# EAGLE design ChassisCab-mega328 (EAGLE 8.1.0)
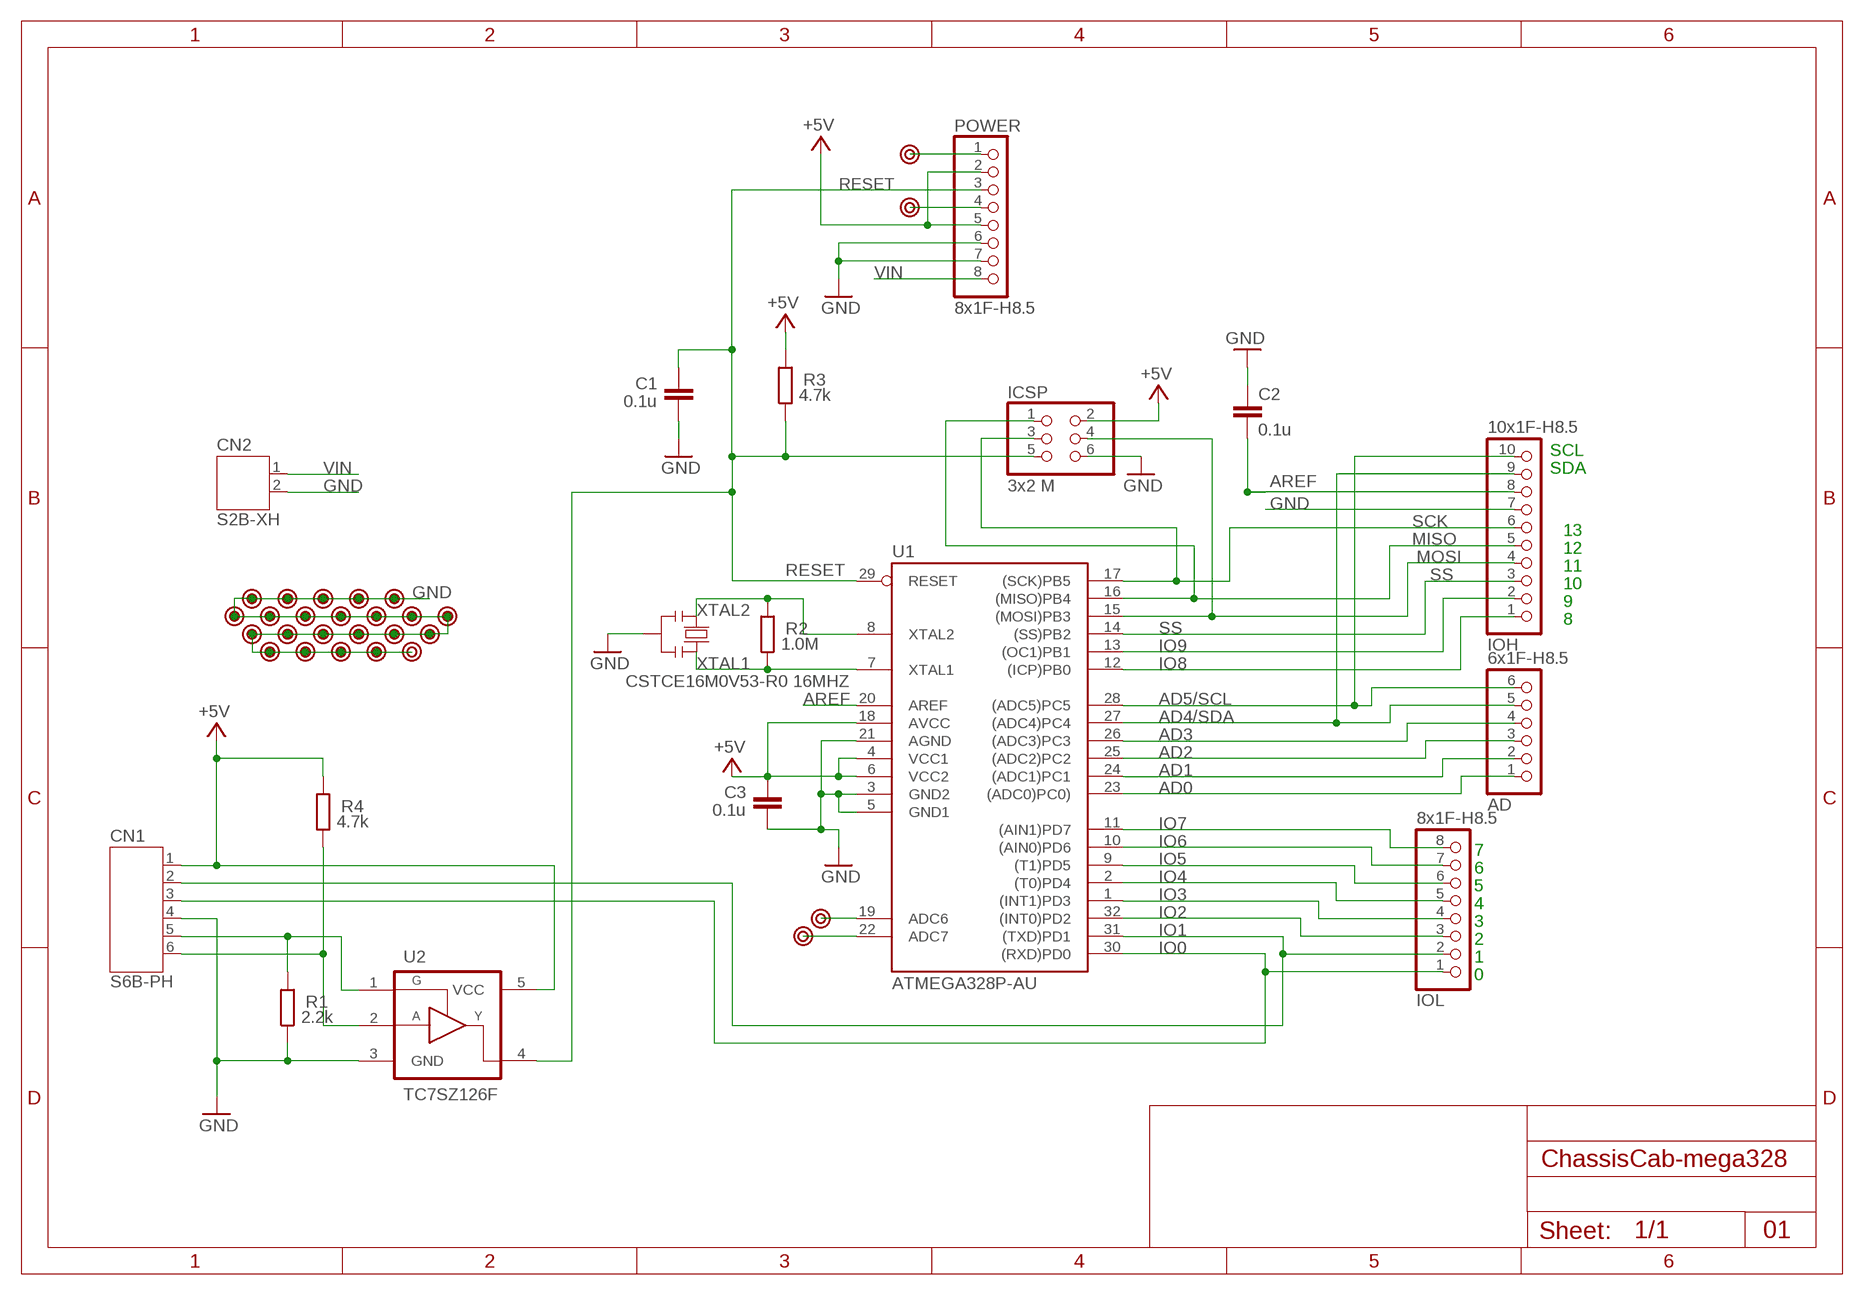
[diagram p0: schematic, sheet 1]

## Parts
AD  6x1F-H8.5  PINHD-1X6  [1X06]
C1  0.1u  C-EUC0603  [C0603]
C2  0.1u  C-EUC0603  [C0603]
C3  0.1u  C-EUC0603  [C0603]
CN1  S6B-PH  [S6B-PH]
CN2  S2B-XH  [S2B-XH]
ICSP  3x2 M  PINHD-2X3  [2X03]
IOH  10x1F-H8.5  PINHD-1X10_ARD  [1X10]
IOL  8x1F-H8.5  PINHD-1X8  [1X08]
POWER  8x1F-H8.5  PINHD-1X8  [1X08]
R1  2.2k  R-EU_R0603  [R0603]
R2  1.0M  R-EU_R0603  [R0603]
R3  4.7k  R-EU_R0603  [R0603]
R4  4.7k  R-EU_R0603  [R0603]
U1  ATMEGA328P-AU  [TQFP32]
U2  TC7SZ126F  [SMV]
U$1  PAD  [PAD]
U$2  PAD  [PAD]
U$3  PAD  [PAD]
U$4  PAD  [PAD]
U$5  PAD  [PAD]
U$6  PAD  [PAD]
U$7  PAD  [PAD]
U$8  PAD  [PAD]
U$9  PAD  [PAD]
U$10  PAD  [PAD]
U$11  PAD  [PAD]
U$12  PAD  [PAD]
U$13  PAD  [PAD]
U$14  PAD  [PAD]
U$15  PAD  [PAD]
U$16  PAD  [PAD]
U$17  PAD  [PAD]
U$18  PAD  [PAD]
U$19  PAD  [PAD]
U$20  PAD  [PAD]
U$21  PAD  [PAD]
U$22  PAD  [PAD]
U$23  PAD  [PAD]
U$24  PAD  [PAD]
U$25  PAD  [PAD]
U$26  PAD  [PAD]
U$27  PAD  [PAD]
X1  CSTCE16M0V53-R0 16MHZ  CSTCE16M0V53-R0  [CSTCE_V]

## Nets
+5V [power]: C3.2 CN1.1 ICSP.2 POWER.2 POWER.5 R3.2 R4.2 U1.4(VCC1) U1.6(VCC2) U1.18(AVCC) U2.5(VCC)
AD0: AD.1 U1.23((ADC0)PC0))
AD1: AD.2 U1.24((ADC1)PC1)
AD2: AD.3 U1.25((ADC2)PC2)
AD3: AD.4 U1.26((ADC3)PC3)
AD4/SDA: AD.5 IOH.9 U1.27((ADC4)PC4)
AD5/SCL: AD.6 IOH.10 U1.28((ADC5)PC5)
AD6: U1.19(ADC6) U$1.1
AD7: U1.22(ADC7) U$2.1
AREF [aref]: C2.2 IOH.8 U1.20(AREF)
GND [gnd]: C1.1 C2.1 C3.1 CN1.4 CN2.2 ICSP.6 IOH.7 POWER.6 POWER.7 R1.1 U1.3(GND2) U1.5(GND1) U1.21(AGND) U2.3(GND) U$3.1 U$4.1 U$5.1 U$6.1 U$7.1 U$8.1 U$9.1 U$10.1 U$11.1 U$12.1 U$13.1 U$14.1 U$15.1 U$16.1 U$17.1 U$18.1 U$19.1 U$20.1 U$21.1 U$22.1 U$23.1 U$24.1 U$27.1 X1.2
IO0: CN1.3 IOL.1 U1.30((RXD)PD0)
IO1: CN1.2 IOL.2 U1.31((TXD)PD1)
IO2: IOL.3 U1.32((INT0)PD2)
IO3: IOL.4 U1.1((INT1)PD3)
IO4: IOL.5 U1.2((T0)PD4)
IO5: IOL.6 U1.9((T1)PD5)
IO6: IOL.7 U1.10((AIN0)PD6)
IO7: IOL.8 U1.11((AIN1)PD7)
IO8: IOH.1 U1.12((ICP)PB0)
IO9: IOH.2 U1.13((OC1)PB1)
MISO: ICSP.1 IOH.5 U1.16((MISO)PB4)
MOSI: ICSP.4 IOH.4 U1.15((MOSI)PB3)
N$1: CN1.5 R1.2 U2.1(G)
N$2: CN1.6 R4.1 U2.2(A)
N$3: POWER.1 U$25.1
N$4: POWER.4 U$26.1
RESET: C1.2 ICSP.5 POWER.3 R3.1 U1.29(RESET) U2.4(Y)
SCK: ICSP.3 IOH.6 U1.17((SCK)PB5)
SS: IOH.3 U1.14((SS)PB2)
VIN [power]: CN2.1 POWER.8
XTAL1: R2.1 U1.7(XTAL1) X1.3
XTAL2: R2.2 U1.8(XTAL2) X1.1

## Notes on the sheet
- SCL
- SDA
- 13
- 12
- 11
- 10
- 9
- 8
- 7
- 6
- 5
- 4
- 3
- 2
- 1
- 0
- 01

## Library data of the parts
AD = arduino:PINHD-1X6: PIN HEADER
C1-C3 = rcl:C-EU: CAPACITOR, European symbol
CN1 = jst:S6B-PH
CN2 = jst:S2B-XH
ICSP = arduino:PINHD-2X3: PIN HEADER
IOH = arduino:PINHD-1X10_ARD: PIN HEADER
IOL POWER = arduino:PINHD-1X8: PIN HEADER
R1-R4 = rcl:R-EU_: RESISTOR, European symbol
U1 = atmel:ATMEGA328P-AU: MICROCONTROLLER 4 Kbytes FLASH 128 bytes SRAM 256 bytes EEPROM UART 6-channel 10 bit ADC
U2 = toshiba:TC7SZ126F
U$1-U$27 = Misc:PAD
X1 = murata:CSTCE16M0V53-R0: 16.000MHz

## Net classes
0 default: width 0.102 mm, drill 0.3 mm
1 power: width 0.102 mm, drill 0.3 mm
2 gnd: width 0.102 mm, drill 0.3 mm
3 usbvcc: width 0.102 mm, drill 0.3 mm
4 aref: width 0.102 mm, drill 0.3 mm

## Board
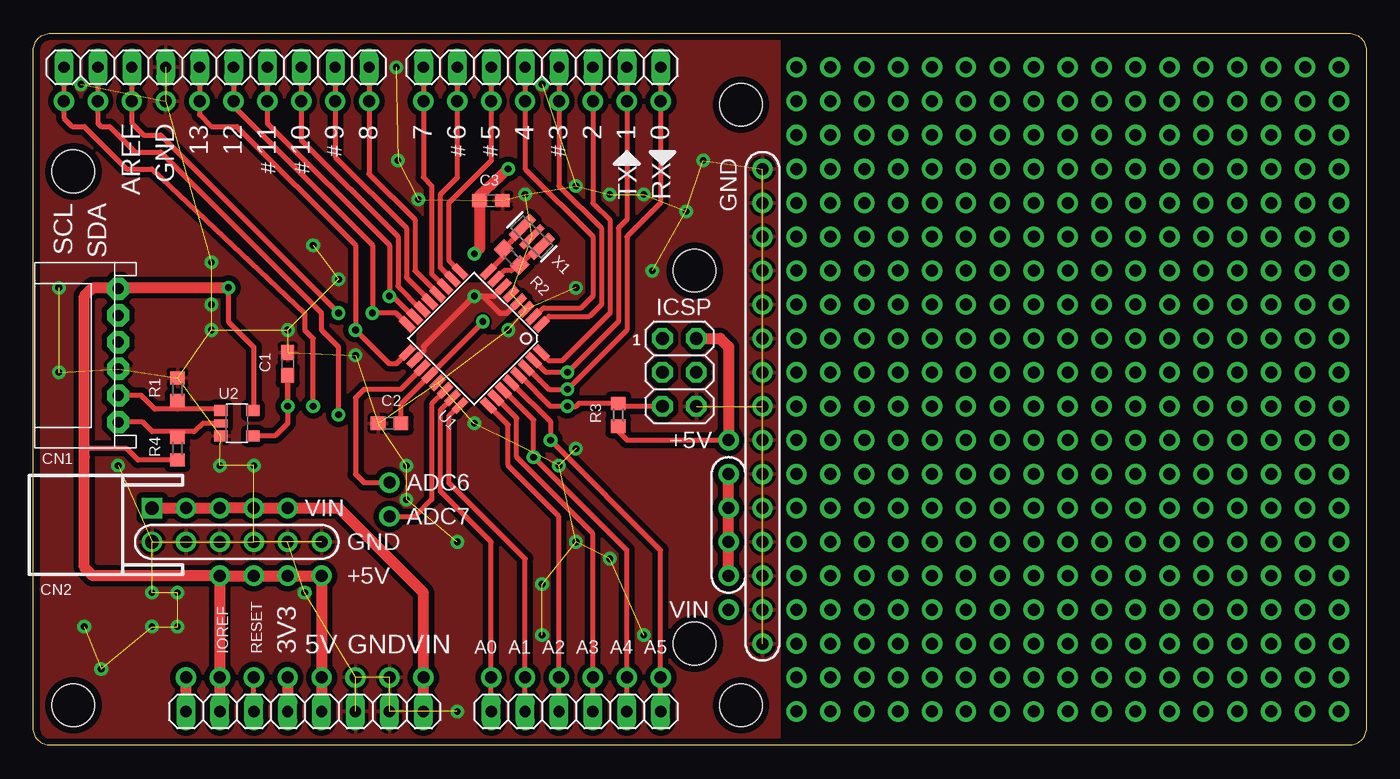
[diagram p1: board, top side]
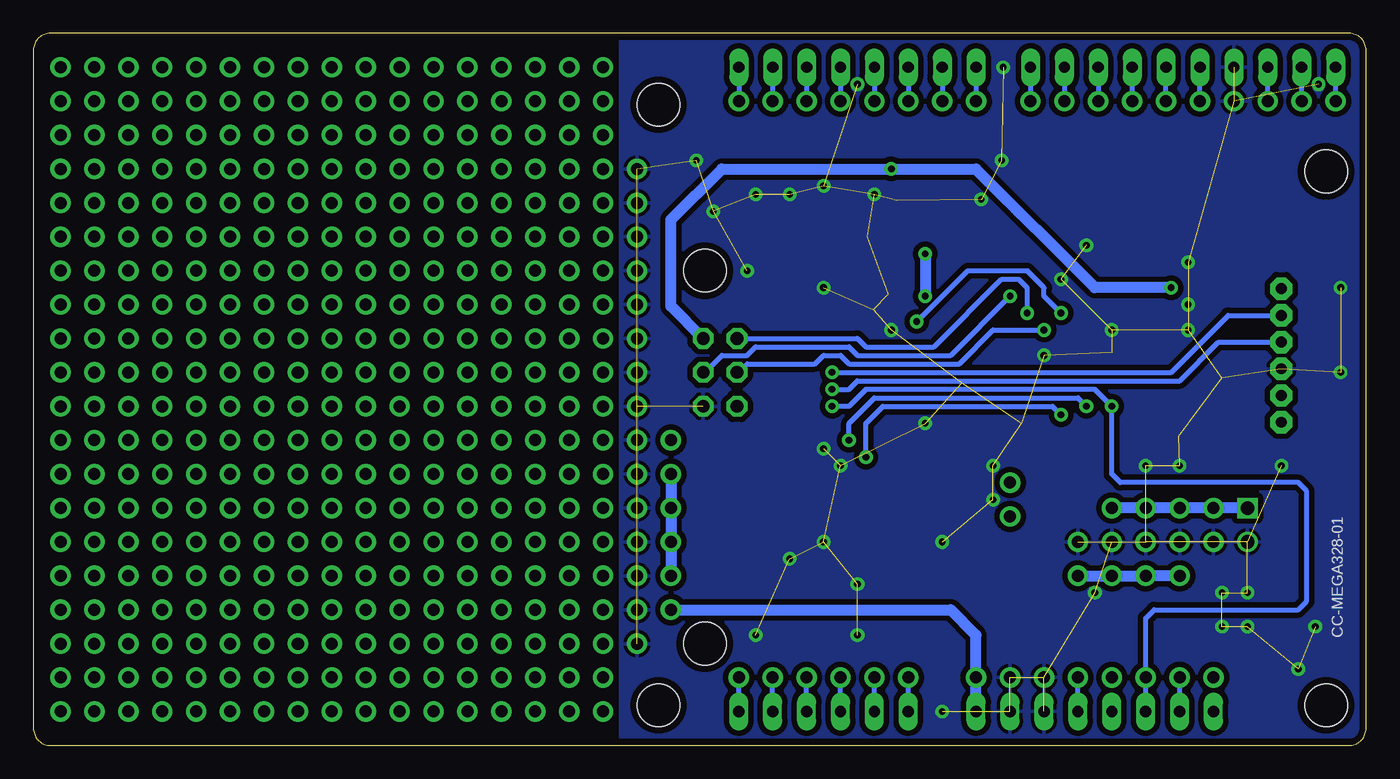
[diagram p2: board, bottom side, seen from below]

Size 99.82 x 53.34 mm. Coordinates in mm from the lower left corner, seen from the top.
Outline: 98.55,53.34 arc-90 99.82,52.07 99.82,1.27 arc-90 98.55,0 1.27,0 arc-90 0,1.27 0,52.07 arc-90 1.27,53.34 98.55,53.34
Copper layers (1*16): Top 0.035mm / dielectric 1.6mm / Bottom 0.035mm
Design rules "Elecrow_2-layer_PCB_eagle_rule": minimum track width 6mil, minimum drill 12mil, track to track 6mil, track to pad 6mil, pad to pad 6mil, via to via 8mil, smd to smd 0mil, copper to edge 20mil, drill to drill 10mil, minimum pad ring 6mil, minimum via ring 6mil, stop-mask expansion 0mil, vias tented up to drill 100mil, thermal gap 10mil
Holes 3.2 mm at 49.53,35.56 49.53,7.62 3,43 3,3 53,48 53,3
vRestrict: area 6.3,41.5 to 8,46.6; area 8.9,42.9 to 10.5,46.6; area 11.9,42.8 to 13.1,46.2; area 14.5,42.8 to 15.6,46.2; area 17,42.8 to 18.2,46.2; area 19.6,42.8 to 20.7,46.2; area 22.2,44.7 to 23.4,46.2; area 28.3,45 to 29.6,46.4; area 31.1,44.8 to 32.3,46.4; area 33.7,44.8 to 34.8,46.4; area 36.3,44.8 to 37.5,46.4; area 38.7,44.8 to 39.9,46.4; 4 more areas

### Footprints (pad centres in the part's own frame; a part is rotated, then mirrored left to right if it is on the bottom)
1X06 = drill 0.85 pad 1.422 long: 1 -6.35,0; 2 -3.81,0; 3 -1.27,0; 4 1.27,0; 5 3.81,0; 6 6.35,0
C0603 = smd 1.1 x 1: 1 -0.85,0; 2 0.85,0
S6B-PH = drill 0.813 pad 1.676 octagon: 1 -5,0; 2 -3,0; 3 -1,0; 4 1,0; 5 3,0; 6 5,0
S2B-XH = drill 1.016 square: 1 -1.27,0 | drill 1.016: 2 1.27,0
2X03 = drill 0.95 pad 1.55 octagon: 1 -2.54,-1.27; 2 -2.54,1.27; 3 0,-1.27; 4 0,1.27; 5 2.54,-1.27; 6 2.54,1.27
1X10 = drill 0.85 pad 1.422 long: 1 -11.43,0; 2 -8.89,0; 3 -6.35,0; 4 -3.81,0; 5 -1.27,0; 6 1.27,0; 7 3.81,0; 8 6.35,0; 9 8.89,0; 10 11.43,0
1X08 = drill 0.85 pad 1.422 long: 1 -8.89,0; 2 -6.35,0; 3 -3.81,0; 4 -1.27,0; 5 1.27,0; 6 3.81,0; 7 6.35,0; 8 8.89,0
R0603 = smd 1 x 1.1: 1 -0.85,0; 2 0.85,0
TQFP32 = smd 1.27 x 0.559: 1 -4.293,2.8; 2 -4.293,2; 3 -4.293,1.2; 4 -4.293,0.4; 5 -4.293,-0.4; 6 -4.293,-1.2; 7 -4.293,-2; 8 -4.293,-2.8; 17 4.293,-2.8; 18 4.293,-2; 19 4.293,-1.2; 20 4.293,-0.4; 21 4.293,0.4; 22 4.293,1.2; 23 4.293,2; 24 4.293,2.8 | smd 0.559 x 1.27: 9 -2.8,-4.293; 10 -2,-4.293; 11 -1.2,-4.293; 12 -0.4,-4.293; 13 0.4,-4.293; 14 1.2,-4.293; 15 2,-4.293; 16 2.8,-4.293; 25 2.8,4.293; 26 2,4.293; 27 1.2,4.293; 28 0.4,4.293; 29 -0.4,4.293; 30 -1.2,4.293; 31 -2,4.293; 32 -2.8,4.293
SMV = smd 0.8 x 1: 1 -0.95,-1.2; 3 0.95,-1.2; 4 0.95,1.2; 5 -0.95,1.2 | smd 0.6 x 1: 2 0,-1.2
PAD = drill 0.9 pad 1.524: 1 0,0
CSTCE_V = smd 0.7 x 2.2: 1 -1,0; 3 1,0 | smd 0.5 x 2.2: 2 0,0

### Placement (x,y rotation side)
AD  40.64,2.54 0 top
C1  19.05,28.57 270 top
C2  26.67,24.13 0 top
C3  34.27,40.8 180 top
CN1  6.35,29.21 270 top
CN2  8.89,16.51 270 top
ICSP  48.39,27.94 270 top
IOH  13.72,50.8 180 top
IOL  38.1,50.8 180 top
POWER  20.32,2.54 0 top
R1  10.79,26.67 270 top
R2  35.81,36.58 135 top
R3  43.81,24.77 270 top
R4  10.79,22.23 270 top
U1  33.02,30.48 225 top
U2  15.24,24.13 270 top
U$1  26.67,19.68 0 top
U$2  26.67,17.14 0 top
U$3  54.61,15.24 0 top
U$4  54.61,10.16 0 top
U$5  9.91,48.26 0 top
U$6  24.13,5.08 0 top
U$7  54.61,7.62 0 top
U$8  26.67,5.08 0 top
U$9  54.61,17.78 0 top
U$10  54.61,35.56 0 top
U$11  54.61,33.02 0 top
U$12  54.61,38.1 0 top
U$13  54.61,40.64 0 top
U$14  54.61,43.18 0 top
U$15  54.61,12.7 0 top
U$16  54.61,30.48 0 top
U$17  16.51,15.24 0 top
U$18  13.97,15.24 0 top
U$19  54.61,27.94 0 top
U$20  19.05,15.24 0 top
U$21  54.61,22.86 0 top
U$22  11.43,15.24 0 top
U$23  54.61,25.4 0 top
U$24  54.61,20.32 0 top
U$25  11.43,5.08 0 top
U$26  19.05,5.08 0 top
U$27  21.59,15.24 0 top
X1  37.34,38.1 315 top

### Tracks (layer width: path | path; a pad name or v marks a point on that pad's centre or on a via)
+5V  (via drill 0.5 pad 1.02, 0.9 pad 1.52)
  Top 0.381: 35.21,34.32 U1.6 34.5,33.66 33.66,33.66 34.92,32.38 35.49,32.38 U1.4 | U1.4 36.34,33.16 | 28.61,28.86 U1.18 29.24,29.53 29.24,29.88 | U1.4 36.48,33.23 | R3.2 43.81,23.5 44.45,22.86 v52.07,22.86 | CN1.1 6.43,34.29 | v14.61,34.29 14.61,31.75 16.51,29.84 16.51,25.15 U2.5 | 4.03,21.38 3.81,21.59 | R4.2 7.83,21.38 6.99,22.23 3.81,22.23
  Top 0.406: 33.4,40.91 C3.2 | 33.66,33.66 v33.02,33.66 29.24,29.88
  Top 0.813: ICSP.2 51.44,30.48 52.07,29.84 v52.07,22.86 | 6.43,34.29 v14.61,34.29 | v13.97,12.7 4.45,12.7 3.81,13.34 3.81,21.59 3.81,22.23 3.81,33.66 4.45,34.29 6.27,34.29 CN1.1 | v13.97,12.7 v21.59,12.7 POWER.5 | v13.97,12.7 POWER.2 | v35.56,43.18 33.4,41.15 33.4,40.91 | C3.2 33.42,37.23 v33.02,36.83
  Bottom 0.381: 29.21,43.18 v35.56,43.18 | POWER.2 v13.97,5.08 | POWER.5 v21.59,5.08
  Bottom 0.813: v14.61,34.29 20.32,34.29 29.21,43.18 48.26,43.18 52.07,39.37 52.07,32.89 ICSP.2 | v33.02,36.83 v33.02,33.66 | v21.59,12.7 v19.05,12.7 v16.51,12.7 v13.97,12.7
  pour Top: 29.84,28.83 28.83,29.84 28.83,30.86 32.51,34.54 33.66,34.54 35.69,32.51 34.42,31.24 33.4,32.26 33.27,32.26
AD0  (via drill 0.9 pad 1.52)
  Top 0.381: AD.1 34.29,15.24 30.48,19.05 30.48,25.11 U1.23 31.36,26.03
  Bottom 0.381: AD.1 v34.29,5.08
AD1  (via drill 0.9 pad 1.52)
  Top 0.381: AD.2 36.83,13.97 31.11,19.68 31.11,24.64 31.84,25.36 31.96,25.36 U1.24
  Bottom 0.381: AD.2 v36.83,5.08
AD2  (via drill 0.9 pad 1.52)
  Top 0.381: AD.3 39.37,17.14 35.56,20.95 35.56,24 34.1,25.46 U1.25
  Bottom 0.381: AD.3 v39.37,5.08
AD3  (via drill 0.9 pad 1.52)
  Top 0.381: AD.4 41.91,15.88 36.2,21.59 36.2,24.51 34.68,26.03 U1.26
  Bottom 0.381: AD.4 v41.91,5.08
AD4/SDA  (via drill 0.5 pad 1.02, 0.9 pad 1.52)
  Top 0.381: AD.5 44.45,14.61 v37.47,21.59 37.47,24.38 35.25,26.6 U1.27 | IOH.9 4.83,46.61 5.08,46.35 5.71,46.35 7.62,44.45 9.53,44.45 21.59,32.38 21.59,31.11 22.86,29.84 v22.86,24.77
  Bottom 0.381: v22.86,24.77 23.5,25.4 36.2,25.4 37.47,24.13 v37.47,21.59 | AD.5 v44.45,5.08 | v4.83,48.26 IOH.9
AD5/SCL  (via drill 0.5 pad 1.02, 0.9 pad 1.52)
  Top 0.381: AD.6 46.99,14.61 v38.73,22.86 38.73,24.26 35.83,27.16 U1.28 | IOH.10 2.29,46.99 2.92,46.35 3.81,46.35 6.99,43.18 8.89,43.18 20.32,32.38 20.32,31.11 20.95,30.48 v20.95,25.4
  Bottom 0.381: v20.95,25.4 21.59,26.04 36.83,26.04 38.73,24.13 v38.73,22.86 | AD.6 v46.99,5.08 | v2.29,48.26 IOH.10
AD6
  Top 0.381: U1.19 27.51,26.67 24.77,26.67 24.13,26.04 24.13,20.32 24.77,19.68 U$1.1
AD7
  Top 0.381: U$2.1 28.57,17.14 29.84,18.41 29.84,25.61 U1.22
AREF  (via drill 0.5 pad 1.02, 0.9 pad 1.52)
  Top 0.381: IOH.8 7.37,46.61 8.26,45.72 9.53,45.72 v22.86,32.38 | v33.66,31.75 33.66,31.68 U1.20 27.56,25.59 27.56,24.17 C2.2
  Bottom 0.381: v33.66,31.75 29.84,35.56 25.4,35.56 24.13,34.29 24.13,33.66 v22.86,32.38 | v7.37,48.26 IOH.8
GND  (via drill 0.5 pad 1.02)  (82 unrouted)
  other vias: 38.1,49.53 27.18,50.8 31.75,2.54 40.64,34.29 33.02,24.13 27.3,43.81 20.95,37.47 27.94,18.41 27.94,20.95 1.91,27.94 20.32,11.43 39.37,20.95 40.64,15.24 43.18,13.97 38.1,12.06 38.1,8.26 45.72,8.26 43.18,41.27 45.72,41.27 40.64,41.91 13.34,33.02 10.79,8.89 40.64,22.23 35.56,31.11 13.34,36.2 50.16,43.81 36.83,41.27 31.75,15.24 46.35,35.56 13.34,31.11 24.13,29.21 19.05,31.11 22.86,34.92 48.9,40.01 5.08,5.71 8.89,11.43 10.79,11.43 8.89,8.89 3.56,49.53 13.97,20.95 16.51,20.95 6.35,20.95 1.91,34.29 3.81,8.89 28.83,40.89
  pour Bottom (isolate 0.406, rank 2): -2.54,55.88 55.88,55.88 55.88,-2.54 -2.54,-2.54
  pour Top (isolate 0.406, rank 2): -1.27,54.61 55.88,54.61 55.88,-1.27 -1.27,-1.27
IO0  (via drill 0.5 pad 1.02, 0.9 pad 1.52)
  Top 0.381: IOL.1 46.99,40.64 44.45,38.1 44.45,31.11 v40.01,26.67 38.61,26.67 36.98,28.29 U1.30
  Bottom 0.381: v40.01,26.67 38.73,26.67 38.1,27.3 13.97,27.3 11.06,30.21 CN1.3 | IOL.1 v46.99,48.26
IO1  (via drill 0.5 pad 1.02, 0.9 pad 1.52)
  Top 0.381: IOL.2 44.45,39.37 43.81,38.73 43.81,31.75 v40.01,27.94 38.39,27.94 U1.31 37.47,28.82
  Bottom 0.381: v40.01,27.94 14.61,27.94 10.34,32.21 CN1.2 | IOL.2 v44.45,48.26
IO2  (via drill 0.9 pad 1.52)
  Top 0.381: IOL.3 41.91,40.64 43.18,39.37 43.18,32.38 39.62,28.83 38.61,28.83 38.03,29.4 U1.32
  Bottom 0.381: IOL.3 v41.91,48.26
IO3  (via drill 0.9 pad 1.52)
  Top 0.381: IOL.4 39.37,41.91 42.55,38.73 42.55,33.02 41.66,32.13 38.61,32.13 38.03,31.56 U1.1
  Bottom 0.381: IOL.4 v39.37,48.26
IO4  (via drill 0.9 pad 1.52)
  Top 0.381: IOL.5 36.83,43.18 41.91,38.1 41.91,33.66 41.02,32.77 38.23,32.77 37.56,32.1 U1.2
  Bottom 0.381: IOL.5 v36.83,48.26
IO5  (via drill 0.9 pad 1.52)
  Top 0.381: IOL.6 34.29,43.81 31.11,40.64 31.11,36.32 31.94,35.49 U1.9
  Bottom 0.381: IOL.6 v34.29,48.26
IO6  (via drill 0.9 pad 1.52)
  Top 0.381: IOL.7 31.75,42.55 30.48,41.27 30.48,35.81 31.36,34.93 U1.10
  Bottom 0.381: IOL.7 v31.75,48.26
IO7  (via drill 0.9 pad 1.52)
  Top 0.381: IOL.8 29.21,42.55 29.84,41.91 29.84,35.31 30.79,34.36 U1.11
  Bottom 0.381: IOL.8 v29.21,48.26
IO8  (via drill 0.9 pad 1.52)
  Top 0.381: IOH.1 25.15,42.8 28.57,39.37 28.57,35.56 30.27,33.87 U1.12
  Bottom 0.381: IOH.1 v25.15,48.26
IO9  (via drill 0.9 pad 1.52)
  Top 0.381: IOH.2 22.61,44.07 27.94,38.73 27.94,35.05 29.7,33.29 U1.13
  Bottom 0.381: IOH.2 v22.61,48.26
MISO  (via drill 0.5 pad 1.02, 0.9 pad 1.52)
  Top 0.381: IOH.5 14.99,47.88 25.4,37.47 v25.4,32.38 27.18,32.38 28,31.56 U1.16
  Bottom 0.381: ICSP.1 38.1,30.48 37.47,29.84 32.38,29.84 27.3,34.92 26.04,34.92 25.4,34.29 v25.4,32.38 | v14.99,48.26 IOH.5
MOSI  (via drill 0.5 pad 1.02, 0.9 pad 1.52)
  Top 0.381: IOH.4 17.53,46.61 26.67,37.47 v26.67,33.66 26.92,33.66 28.48,32.1 U1.15
  Bottom 0.381: ICSP.4 49.53,27.94 48.26,29.21 46.35,29.21 45.72,29.84 38.73,29.84 38.1,29.21 31.11,29.21 v26.67,33.66 | v17.53,48.26 IOH.4
N$1
  Top 0.381: U2.1 13.94,25.18 10.79,25.18 | R1.2 10.58,25.4 10.79,25.18 | CN1.5 8.08,26.21 9.11,25.18 10.79,25.18
N$2
  Top 0.381: U2.2 12.7,24.13 12.06,23.5 10.79,23.5 | 10.79,23.5 8.89,23.5 8.18,24.21 CN1.6 | R4.1 10.79,23.5
N$3
  Top 0.813: POWER.1 U$25.1
N$4
  Top 0.813: U$26.1 POWER.4
N$5  (via drill 0.9 pad 1.52)
  other vias: 57.15,50.8
N$6  (via drill 0.9 pad 1.52)
  other vias: 57.15,48.26
N$7  (via drill 0.9 pad 1.52)
  other vias: 57.15,45.72
N$8  (via drill 0.9 pad 1.52)
  other vias: 57.15,43.18
N$9  (via drill 0.9 pad 1.52)
  other vias: 57.15,40.64
N$10  (via drill 0.9 pad 1.52)
  other vias: 57.15,38.1
N$11  (via drill 0.9 pad 1.52)
  other vias: 57.15,35.56
N$12  (via drill 0.9 pad 1.52)
  other vias: 57.15,33.02
N$13  (via drill 0.9 pad 1.52)
  other vias: 57.15,30.48
N$14  (via drill 0.9 pad 1.52)
  other vias: 57.15,27.94
N$15  (via drill 0.9 pad 1.52)
  other vias: 57.15,25.4
N$16  (via drill 0.9 pad 1.52)
  other vias: 57.15,22.86
N$17  (via drill 0.9 pad 1.52)
  other vias: 57.15,20.32
N$18  (via drill 0.9 pad 1.52)
  other vias: 57.15,17.78
N$19  (via drill 0.9 pad 1.52)
  other vias: 57.15,15.24
N$20  (via drill 0.9 pad 1.52)
  other vias: 57.15,12.7
N$21  (via drill 0.9 pad 1.52)
  other vias: 57.15,10.16
N$22  (via drill 0.9 pad 1.52)
  other vias: 57.15,7.62
N$23  (via drill 0.9 pad 1.52)
  other vias: 57.15,5.08
N$24  (via drill 0.9 pad 1.52)
  other vias: 57.15,2.54
N$25  (via drill 0.9 pad 1.52)
  other vias: 59.69,50.8
N$26  (via drill 0.9 pad 1.52)
  other vias: 59.69,48.26
N$27  (via drill 0.9 pad 1.52)
  other vias: 59.69,45.72
N$28  (via drill 0.9 pad 1.52)
  other vias: 59.69,43.18
N$29  (via drill 0.9 pad 1.52)
  other vias: 59.69,40.64
N$30  (via drill 0.9 pad 1.52)
  other vias: 59.69,38.1
N$31  (via drill 0.9 pad 1.52)
  other vias: 59.69,35.56
N$32  (via drill 0.9 pad 1.52)
  other vias: 59.69,33.02
N$33  (via drill 0.9 pad 1.52)
  other vias: 59.69,30.48
N$34  (via drill 0.9 pad 1.52)
  other vias: 59.69,27.94
N$35  (via drill 0.9 pad 1.52)
  other vias: 59.69,25.4
N$36  (via drill 0.9 pad 1.52)
  other vias: 59.69,22.86
N$37  (via drill 0.9 pad 1.52)
  other vias: 59.69,20.32
N$38  (via drill 0.9 pad 1.52)
  other vias: 59.69,17.78
N$39  (via drill 0.9 pad 1.52)
  other vias: 59.69,15.24
N$40  (via drill 0.9 pad 1.52)
  other vias: 59.69,12.7
N$41  (via drill 0.9 pad 1.52)
  other vias: 59.69,10.16
N$42  (via drill 0.9 pad 1.52)
  other vias: 59.69,7.62
N$43  (via drill 0.9 pad 1.52)
  other vias: 59.69,5.08
N$44  (via drill 0.9 pad 1.52)
  other vias: 59.69,2.54
N$45  (via drill 0.9 pad 1.52)
  other vias: 62.23,50.8
N$46  (via drill 0.9 pad 1.52)
  other vias: 62.23,48.26
N$47  (via drill 0.9 pad 1.52)
  other vias: 62.23,45.72
N$48  (via drill 0.9 pad 1.52)
  other vias: 62.23,43.18
N$49  (via drill 0.9 pad 1.52)
  other vias: 62.23,40.64
N$50  (via drill 0.9 pad 1.52)
  other vias: 62.23,38.1
N$51  (via drill 0.9 pad 1.52)
  other vias: 62.23,35.56
N$52  (via drill 0.9 pad 1.52)
  other vias: 62.23,33.02
N$53  (via drill 0.9 pad 1.52)
  other vias: 62.23,30.48
N$54  (via drill 0.9 pad 1.52)
  other vias: 62.23,27.94
N$55  (via drill 0.9 pad 1.52)
  other vias: 62.23,25.4
N$56  (via drill 0.9 pad 1.52)
  other vias: 62.23,22.86
N$57  (via drill 0.9 pad 1.52)
  other vias: 62.23,20.32
N$58  (via drill 0.9 pad 1.52)
  other vias: 62.23,17.78
N$59  (via drill 0.9 pad 1.52)
  other vias: 62.23,15.24
N$60  (via drill 0.9 pad 1.52)
  other vias: 62.23,12.7
N$61  (via drill 0.9 pad 1.52)
  other vias: 62.23,10.16
N$62  (via drill 0.9 pad 1.52)
  other vias: 62.23,7.62
N$63  (via drill 0.9 pad 1.52)
  other vias: 62.23,5.08
N$64  (via drill 0.9 pad 1.52)
  other vias: 62.23,2.54
N$65  (via drill 0.9 pad 1.52)
  other vias: 64.77,50.8
N$66  (via drill 0.9 pad 1.52)
  other vias: 64.77,48.26
N$67  (via drill 0.9 pad 1.52)
  other vias: 64.77,45.72
N$68  (via drill 0.9 pad 1.52)
  other vias: 64.77,43.18
N$69  (via drill 0.9 pad 1.52)
  other vias: 64.77,40.64
N$70  (via drill 0.9 pad 1.52)
  other vias: 64.77,38.1
N$71  (via drill 0.9 pad 1.52)
  other vias: 64.77,35.56
N$72  (via drill 0.9 pad 1.52)
  other vias: 64.77,33.02
N$73  (via drill 0.9 pad 1.52)
  other vias: 64.77,30.48
N$74  (via drill 0.9 pad 1.52)
  other vias: 64.77,27.94
N$75  (via drill 0.9 pad 1.52)
  other vias: 64.77,25.4
N$76  (via drill 0.9 pad 1.52)
  other vias: 64.77,22.86
N$77  (via drill 0.9 pad 1.52)
  other vias: 64.77,20.32
N$78  (via drill 0.9 pad 1.52)
  other vias: 64.77,17.78
N$79  (via drill 0.9 pad 1.52)
  other vias: 64.77,15.24
N$80  (via drill 0.9 pad 1.52)
  other vias: 64.77,12.7
N$81  (via drill 0.9 pad 1.52)
  other vias: 64.77,10.16
N$82  (via drill 0.9 pad 1.52)
  other vias: 64.77,7.62
N$83  (via drill 0.9 pad 1.52)
  other vias: 64.77,5.08
N$84  (via drill 0.9 pad 1.52)
  other vias: 64.77,2.54
N$85  (via drill 0.9 pad 1.52)
  other vias: 67.31,50.8
N$86  (via drill 0.9 pad 1.52)
  other vias: 67.31,48.26
N$87  (via drill 0.9 pad 1.52)
  other vias: 67.31,45.72
N$88  (via drill 0.9 pad 1.52)
  other vias: 67.31,43.18
N$89  (via drill 0.9 pad 1.52)
  other vias: 67.31,40.64
N$90  (via drill 0.9 pad 1.52)
  other vias: 67.31,38.1
N$91  (via drill 0.9 pad 1.52)
  other vias: 67.31,35.56
N$92  (via drill 0.9 pad 1.52)
  other vias: 67.31,33.02
N$93  (via drill 0.9 pad 1.52)
  other vias: 67.31,30.48
N$94  (via drill 0.9 pad 1.52)
  other vias: 67.31,27.94
N$95  (via drill 0.9 pad 1.52)
  other vias: 67.31,25.4
N$96  (via drill 0.9 pad 1.52)
  other vias: 67.31,22.86
N$97  (via drill 0.9 pad 1.52)
  other vias: 67.31,20.32
N$98  (via drill 0.9 pad 1.52)
  other vias: 67.31,17.78
N$99  (via drill 0.9 pad 1.52)
  other vias: 67.31,15.24
N$100  (via drill 0.9 pad 1.52)
  other vias: 67.31,12.7
N$101  (via drill 0.9 pad 1.52)
  other vias: 67.31,10.16
N$102  (via drill 0.9 pad 1.52)
  other vias: 67.31,7.62
N$103  (via drill 0.9 pad 1.52)
  other vias: 67.31,5.08
N$104  (via drill 0.9 pad 1.52)
  other vias: 67.31,2.54
N$105  (via drill 0.9 pad 1.52)
  other vias: 69.85,50.8
N$106  (via drill 0.9 pad 1.52)
  other vias: 69.85,48.26
N$107  (via drill 0.9 pad 1.52)
  other vias: 69.85,45.72
N$108  (via drill 0.9 pad 1.52)
  other vias: 69.85,43.18
N$109  (via drill 0.9 pad 1.52)
  other vias: 69.85,40.64
N$110  (via drill 0.9 pad 1.52)
  other vias: 69.85,38.1
N$111  (via drill 0.9 pad 1.52)
  other vias: 69.85,35.56
N$112  (via drill 0.9 pad 1.52)
  other vias: 69.85,33.02
N$113  (via drill 0.9 pad 1.52)
  other vias: 69.85,30.48
N$114  (via drill 0.9 pad 1.52)
  other vias: 69.85,27.94
N$115  (via drill 0.9 pad 1.52)
  other vias: 69.85,25.4
N$116  (via drill 0.9 pad 1.52)
  other vias: 69.85,22.86
N$117  (via drill 0.9 pad 1.52)
  other vias: 69.85,20.32
N$118  (via drill 0.9 pad 1.52)
  other vias: 69.85,17.78
N$119  (via drill 0.9 pad 1.52)
  other vias: 69.85,15.24
N$120  (via drill 0.9 pad 1.52)
  other vias: 69.85,12.7
N$121  (via drill 0.9 pad 1.52)
  other vias: 69.85,10.16
N$122  (via drill 0.9 pad 1.52)
  other vias: 69.85,7.62
N$123  (via drill 0.9 pad 1.52)
  other vias: 69.85,5.08
N$124  (via drill 0.9 pad 1.52)
  other vias: 69.85,2.54
N$125  (via drill 0.9 pad 1.52)
  other vias: 72.39,50.8
N$126  (via drill 0.9 pad 1.52)
  other vias: 72.39,48.26
N$127  (via drill 0.9 pad 1.52)
  other vias: 72.39,45.72
N$128  (via drill 0.9 pad 1.52)
  other vias: 72.39,43.18
N$129  (via drill 0.9 pad 1.52)
  other vias: 72.39,40.64
N$130  (via drill 0.9 pad 1.52)
  other vias: 72.39,38.1
N$131  (via drill 0.9 pad 1.52)
  other vias: 72.39,35.56
N$132  (via drill 0.9 pad 1.52)
  other vias: 72.39,33.02
N$133  (via drill 0.9 pad 1.52)
  other vias: 72.39,30.48
N$134  (via drill 0.9 pad 1.52)
  other vias: 72.39,27.94
N$135  (via drill 0.9 pad 1.52)
  other vias: 72.39,25.4
N$136  (via drill 0.9 pad 1.52)
  other vias: 72.39,22.86
N$137  (via drill 0.9 pad 1.52)
  other vias: 72.39,20.32
N$138  (via drill 0.9 pad 1.52)
  other vias: 72.39,17.78
N$139  (via drill 0.9 pad 1.52)
  other vias: 72.39,15.24
N$140  (via drill 0.9 pad 1.52)
  other vias: 72.39,12.7
N$141  (via drill 0.9 pad 1.52)
  other vias: 72.39,10.16
N$142  (via drill 0.9 pad 1.52)
  other vias: 72.39,7.62
N$143  (via drill 0.9 pad 1.52)
  other vias: 72.39,5.08
N$144  (via drill 0.9 pad 1.52)
  other vias: 72.39,2.54
N$145  (via drill 0.9 pad 1.52)
  other vias: 74.93,50.8
N$146  (via drill 0.9 pad 1.52)
  other vias: 74.93,48.26
N$147  (via drill 0.9 pad 1.52)
  other vias: 74.93,45.72
N$148  (via drill 0.9 pad 1.52)
  other vias: 74.93,43.18
N$149  (via drill 0.9 pad 1.52)
  other vias: 74.93,40.64
N$150  (via drill 0.9 pad 1.52)
  other vias: 74.93,38.1
N$151  (via drill 0.9 pad 1.52)
  other vias: 74.93,35.56
N$152  (via drill 0.9 pad 1.52)
  other vias: 74.93,33.02
N$153  (via drill 0.9 pad 1.52)
  other vias: 74.93,30.48
N$154  (via drill 0.9 pad 1.52)
  other vias: 74.93,27.94
N$155  (via drill 0.9 pad 1.52)
  other vias: 74.93,25.4
N$156  (via drill 0.9 pad 1.52)
  other vias: 74.93,22.86
N$157  (via drill 0.9 pad 1.52)
  other vias: 74.93,20.32
N$158  (via drill 0.9 pad 1.52)
  other vias: 74.93,17.78
N$159  (via drill 0.9 pad 1.52)
  other vias: 74.93,15.24
N$160  (via drill 0.9 pad 1.52)
  other vias: 74.93,12.7
N$161  (via drill 0.9 pad 1.52)
  other vias: 74.93,10.16
N$162  (via drill 0.9 pad 1.52)
  other vias: 74.93,7.62
N$163  (via drill 0.9 pad 1.52)
  other vias: 74.93,5.08
N$164  (via drill 0.9 pad 1.52)
  other vias: 74.93,2.54
N$165  (via drill 0.9 pad 1.52)
  other vias: 77.47,50.8
N$166  (via drill 0.9 pad 1.52)
  other vias: 77.47,48.26
N$167  (via drill 0.9 pad 1.52)
  other vias: 77.47,45.72
N$168  (via drill 0.9 pad 1.52)
  other vias: 77.47,43.18
N$169  (via drill 0.9 pad 1.52)
  other vias: 77.47,40.64
N$170  (via drill 0.9 pad 1.52)
  other vias: 77.47,38.1
N$171  (via drill 0.9 pad 1.52)
  other vias: 77.47,35.56
N$172  (via drill 0.9 pad 1.52)
  other vias: 77.47,33.02
N$173  (via drill 0.9 pad 1.52)
  other vias: 77.47,30.48
N$174  (via drill 0.9 pad 1.52)
  other vias: 77.47,27.94
N$175  (via drill 0.9 pad 1.52)
  other vias: 77.47,25.4
N$176  (via drill 0.9 pad 1.52)
  other vias: 77.47,22.86
N$177  (via drill 0.9 pad 1.52)
  other vias: 77.47,20.32
N$178  (via drill 0.9 pad 1.52)
  other vias: 77.47,17.78
N$179  (via drill 0.9 pad 1.52)
  other vias: 77.47,15.24
N$180  (via drill 0.9 pad 1.52)
  other vias: 77.47,12.7
N$181  (via drill 0.9 pad 1.52)
  other vias: 77.47,10.16
N$182  (via drill 0.9 pad 1.52)
  other vias: 77.47,7.62
N$183  (via drill 0.9 pad 1.52)
  other vias: 77.47,5.08
N$184  (via drill 0.9 pad 1.52)
  other vias: 77.47,2.54
N$185  (via drill 0.9 pad 1.52)
  other vias: 80.01,50.8
N$186  (via drill 0.9 pad 1.52)
  other vias: 80.01,48.26
N$187  (via drill 0.9 pad 1.52)
  other vias: 80.01,45.72
N$188  (via drill 0.9 pad 1.52)
  other vias: 80.01,43.18
N$189  (via drill 0.9 pad 1.52)
  other vias: 80.01,40.64
N$190  (via drill 0.9 pad 1.52)
  other vias: 80.01,38.1
N$191  (via drill 0.9 pad 1.52)
  other vias: 80.01,35.56
N$192  (via drill 0.9 pad 1.52)
  other vias: 80.01,33.02
N$193  (via drill 0.9 pad 1.52)
  other vias: 80.01,30.48
N$194  (via drill 0.9 pad 1.52)
  other vias: 80.01,27.94
N$195  (via drill 0.9 pad 1.52)
  other vias: 80.01,25.4
N$196  (via drill 0.9 pad 1.52)
  other vias: 80.01,22.86
N$197  (via drill 0.9 pad 1.52)
  other vias: 80.01,20.32
N$198  (via drill 0.9 pad 1.52)
  other vias: 80.01,17.78
N$199  (via drill 0.9 pad 1.52)
  other vias: 80.01,15.24
N$200  (via drill 0.9 pad 1.52)
  other vias: 80.01,12.7
N$201  (via drill 0.9 pad 1.52)
  other vias: 80.01,10.16
N$202  (via drill 0.9 pad 1.52)
  other vias: 80.01,7.62
N$203  (via drill 0.9 pad 1.52)
  other vias: 80.01,5.08
N$204  (via drill 0.9 pad 1.52)
  other vias: 80.01,2.54
N$205  (via drill 0.9 pad 1.52)
  other vias: 82.55,50.8
N$206  (via drill 0.9 pad 1.52)
  other vias: 82.55,48.26
N$207  (via drill 0.9 pad 1.52)
  other vias: 82.55,45.72
N$208  (via drill 0.9 pad 1.52)
  other vias: 82.55,43.18
N$209  (via drill 0.9 pad 1.52)
  other vias: 82.55,40.64
N$210  (via drill 0.9 pad 1.52)
  other vias: 82.55,38.1
N$211  (via drill 0.9 pad 1.52)
  other vias: 82.55,35.56
N$212  (via drill 0.9 pad 1.52)
  other vias: 82.55,33.02
N$213  (via drill 0.9 pad 1.52)
  other vias: 82.55,30.48
N$214  (via drill 0.9 pad 1.52)
  other vias: 82.55,27.94
N$215  (via drill 0.9 pad 1.52)
  other vias: 82.55,25.4
N$216  (via drill 0.9 pad 1.52)
  other vias: 82.55,22.86
N$217  (via drill 0.9 pad 1.52)
  other vias: 82.55,20.32
N$218  (via drill 0.9 pad 1.52)
  other vias: 82.55,17.78
N$219  (via drill 0.9 pad 1.52)
  other vias: 82.55,15.24
N$220  (via drill 0.9 pad 1.52)
  other vias: 82.55,12.7
N$221  (via drill 0.9 pad 1.52)
  other vias: 82.55,10.16
N$222  (via drill 0.9 pad 1.52)
  other vias: 82.55,7.62
N$223  (via drill 0.9 pad 1.52)
  other vias: 82.55,5.08
N$224  (via drill 0.9 pad 1.52)
  other vias: 82.55,2.54
N$225  (via drill 0.9 pad 1.52)
  other vias: 85.09,50.8
N$226  (via drill 0.9 pad 1.52)
  other vias: 85.09,48.26
N$227  (via drill 0.9 pad 1.52)
  other vias: 85.09,45.72
N$228  (via drill 0.9 pad 1.52)
  other vias: 85.09,43.18
N$229  (via drill 0.9 pad 1.52)
  other vias: 85.09,40.64
N$230  (via drill 0.9 pad 1.52)
  other vias: 85.09,38.1
N$231  (via drill 0.9 pad 1.52)
  other vias: 85.09,35.56
N$232  (via drill 0.9 pad 1.52)
  other vias: 85.09,33.02
N$233  (via drill 0.9 pad 1.52)
  other vias: 85.09,30.48
N$234  (via drill 0.9 pad 1.52)
  other vias: 85.09,27.94
N$235  (via drill 0.9 pad 1.52)
  other vias: 85.09,25.4
N$236  (via drill 0.9 pad 1.52)
  other vias: 85.09,22.86
N$237  (via drill 0.9 pad 1.52)
  other vias: 85.09,20.32
N$238  (via drill 0.9 pad 1.52)
  other vias: 85.09,17.78
N$239  (via drill 0.9 pad 1.52)
  other vias: 85.09,15.24
N$240  (via drill 0.9 pad 1.52)
  other vias: 85.09,12.7
N$241  (via drill 0.9 pad 1.52)
  other vias: 85.09,10.16
N$242  (via drill 0.9 pad 1.52)
  other vias: 85.09,7.62
N$243  (via drill 0.9 pad 1.52)
  other vias: 85.09,5.08
N$244  (via drill 0.9 pad 1.52)
  other vias: 85.09,2.54
N$245  (via drill 0.9 pad 1.52)
  other vias: 87.63,50.8
N$246  (via drill 0.9 pad 1.52)
  other vias: 87.63,48.26
N$247  (via drill 0.9 pad 1.52)
  other vias: 87.63,45.72
N$248  (via drill 0.9 pad 1.52)
  other vias: 87.63,43.18
N$249  (via drill 0.9 pad 1.52)
  other vias: 87.63,40.64
N$250  (via drill 0.9 pad 1.52)
  other vias: 87.63,38.1
N$251  (via drill 0.9 pad 1.52)
  other vias: 87.63,35.56
N$252  (via drill 0.9 pad 1.52)
  other vias: 87.63,33.02
N$253  (via drill 0.9 pad 1.52)
  other vias: 87.63,30.48
N$254  (via drill 0.9 pad 1.52)
  other vias: 87.63,27.94
N$255  (via drill 0.9 pad 1.52)
  other vias: 87.63,25.4
N$256  (via drill 0.9 pad 1.52)
  other vias: 87.63,22.86
N$257  (via drill 0.9 pad 1.52)
  other vias: 87.63,20.32
N$258  (via drill 0.9 pad 1.52)
  other vias: 87.63,17.78
N$259  (via drill 0.9 pad 1.52)
  other vias: 87.63,15.24
N$260  (via drill 0.9 pad 1.52)
  other vias: 87.63,12.7
N$261  (via drill 0.9 pad 1.52)
  other vias: 87.63,10.16
N$262  (via drill 0.9 pad 1.52)
  other vias: 87.63,7.62
N$263  (via drill 0.9 pad 1.52)
  other vias: 87.63,5.08
N$264  (via drill 0.9 pad 1.52)
  other vias: 87.63,2.54
N$265  (via drill 0.9 pad 1.52)
  other vias: 90.17,50.8
N$266  (via drill 0.9 pad 1.52)
  other vias: 90.17,48.26
N$267  (via drill 0.9 pad 1.52)
  other vias: 90.17,45.72
N$268  (via drill 0.9 pad 1.52)
  other vias: 90.17,43.18
N$269  (via drill 0.9 pad 1.52)
  other vias: 90.17,40.64
N$270  (via drill 0.9 pad 1.52)
  other vias: 90.17,38.1
N$271  (via drill 0.9 pad 1.52)
  other vias: 90.17,35.56
N$272  (via drill 0.9 pad 1.52)
  other vias: 90.17,33.02
N$273  (via drill 0.9 pad 1.52)
  other vias: 90.17,30.48
N$274  (via drill 0.9 pad 1.52)
  other vias: 90.17,27.94
N$275  (via drill 0.9 pad 1.52)
  other vias: 90.17,25.4
N$276  (via drill 0.9 pad 1.52)
  other vias: 90.17,22.86
N$277  (via drill 0.9 pad 1.52)
  other vias: 90.17,20.32
N$278  (via drill 0.9 pad 1.52)
  other vias: 90.17,17.78
N$279  (via drill 0.9 pad 1.52)
  other vias: 90.17,15.24
N$280  (via drill 0.9 pad 1.52)
  other vias: 90.17,12.7
N$281  (via drill 0.9 pad 1.52)
  other vias: 90.17,10.16
N$282  (via drill 0.9 pad 1.52)
  other vias: 90.17,7.62
N$283  (via drill 0.9 pad 1.52)
  other vias: 90.17,5.08
N$284  (via drill 0.9 pad 1.52)
  other vias: 90.17,2.54
N$285  (via drill 0.9 pad 1.52)
  other vias: 92.71,50.8
N$286  (via drill 0.9 pad 1.52)
  other vias: 92.71,48.26
N$287  (via drill 0.9 pad 1.52)
  other vias: 92.71,45.72
N$288  (via drill 0.9 pad 1.52)
  other vias: 92.71,43.18
N$289  (via drill 0.9 pad 1.52)
  other vias: 92.71,40.64
N$290  (via drill 0.9 pad 1.52)
  other vias: 92.71,38.1
N$291  (via drill 0.9 pad 1.52)
  other vias: 92.71,35.56
N$292  (via drill 0.9 pad 1.52)
  other vias: 92.71,33.02
N$293  (via drill 0.9 pad 1.52)
  other vias: 92.71,30.48
N$294  (via drill 0.9 pad 1.52)
  other vias: 92.71,27.94
N$295  (via drill 0.9 pad 1.52)
  other vias: 92.71,25.4
N$296  (via drill 0.9 pad 1.52)
  other vias: 92.71,22.86
N$297  (via drill 0.9 pad 1.52)
  other vias: 92.71,20.32
N$298  (via drill 0.9 pad 1.52)
  other vias: 92.71,17.78
N$299  (via drill 0.9 pad 1.52)
  other vias: 92.71,15.24
N$300  (via drill 0.9 pad 1.52)
  other vias: 92.71,12.7
N$301  (via drill 0.9 pad 1.52)
  other vias: 92.71,10.16
N$302  (via drill 0.9 pad 1.52)
  other vias: 92.71,7.62
N$303  (via drill 0.9 pad 1.52)
  other vias: 92.71,5.08
N$304  (via drill 0.9 pad 1.52)
  other vias: 92.71,2.54
N$305  (via drill 0.9 pad 1.52)
  other vias: 95.25,50.8
N$306  (via drill 0.9 pad 1.52)
  other vias: 95.25,48.26
N$307  (via drill 0.9 pad 1.52)
  other vias: 95.25,45.72
N$308  (via drill 0.9 pad 1.52)
  other vias: 95.25,43.18
N$309  (via drill 0.9 pad 1.52)
  other vias: 95.25,40.64
N$310  (via drill 0.9 pad 1.52)
  other vias: 95.25,38.1
N$311  (via drill 0.9 pad 1.52)
  other vias: 95.25,35.56
N$312  (via drill 0.9 pad 1.52)
  other vias: 95.25,33.02
N$313  (via drill 0.9 pad 1.52)
  other vias: 95.25,30.48
N$314  (via drill 0.9 pad 1.52)
  other vias: 95.25,27.94
N$315  (via drill 0.9 pad 1.52)
  other vias: 95.25,25.4
N$316  (via drill 0.9 pad 1.52)
  other vias: 95.25,22.86
N$317  (via drill 0.9 pad 1.52)
  other vias: 95.25,20.32
N$318  (via drill 0.9 pad 1.52)
  other vias: 95.25,17.78
N$319  (via drill 0.9 pad 1.52)
  other vias: 95.25,15.24
N$320  (via drill 0.9 pad 1.52)
  other vias: 95.25,12.7
N$321  (via drill 0.9 pad 1.52)
  other vias: 95.25,10.16
N$322  (via drill 0.9 pad 1.52)
  other vias: 95.25,7.62
N$323  (via drill 0.9 pad 1.52)
  other vias: 95.25,5.08
N$324  (via drill 0.9 pad 1.52)
  other vias: 95.25,2.54
N$325  (via drill 0.9 pad 1.52)
  other vias: 97.79,50.8
N$326  (via drill 0.9 pad 1.52)
  other vias: 97.79,48.26
N$327  (via drill 0.9 pad 1.52)
  other vias: 97.79,45.72
N$328  (via drill 0.9 pad 1.52)
  other vias: 97.79,43.18
N$329  (via drill 0.9 pad 1.52)
  other vias: 97.79,40.64
N$330  (via drill 0.9 pad 1.52)
  other vias: 97.79,38.1
N$331  (via drill 0.9 pad 1.52)
  other vias: 97.79,35.56
N$332  (via drill 0.9 pad 1.52)
  other vias: 97.79,33.02
N$333  (via drill 0.9 pad 1.52)
  other vias: 97.79,30.48
N$334  (via drill 0.9 pad 1.52)
  other vias: 97.79,27.94
N$335  (via drill 0.9 pad 1.52)
  other vias: 97.79,25.4
N$336  (via drill 0.9 pad 1.52)
  other vias: 97.79,22.86
N$337  (via drill 0.9 pad 1.52)
  other vias: 97.79,20.32
N$338  (via drill 0.9 pad 1.52)
  other vias: 97.79,17.78
N$339  (via drill 0.9 pad 1.52)
  other vias: 97.79,15.24
N$340  (via drill 0.9 pad 1.52)
  other vias: 97.79,12.7
N$341  (via drill 0.9 pad 1.52)
  other vias: 97.79,10.16
N$342  (via drill 0.9 pad 1.52)
  other vias: 97.79,7.62
N$343  (via drill 0.9 pad 1.52)
  other vias: 97.79,5.08
N$344  (via drill 0.9 pad 1.52)
  other vias: 97.79,2.54
N$900  (via drill 0.9 pad 1.52)
  Top 0.813: v52.07,12.7 v52.07,20.32
  Bottom 0.813: v52.07,20.32 v52.07,17.78 v52.07,15.24 v52.07,12.7
RESET  (via drill 0.5 pad 1.02, 0.9 pad 1.52)
  Top 0.381: U1.29 36.41,27.73 38.73,25.4 v40.01,25.4 40.64,25.4 40.85,25.61 R3.1 44.03,25.4 ICSP.5 | 16.51,23.11 U2.4 18.1,23.18 19.05,24.13 v19.05,25.4 | POWER.3 v16.51,5.08
  Top 0.406: C1.2 v19.05,25.4
  Bottom 0.381: v40.01,25.4 38.73,25.4 37.47,26.67 20.32,26.67 v19.05,25.4 19.05,20.32 18.41,19.68 5.08,19.68 4.45,19.05 4.45,10.79 5.08,10.16 15.88,10.16 16.51,9.53 POWER.3
SCK  (via drill 0.5 pad 1.02, 0.9 pad 1.52)
  Top 0.381: IOH.6 12.45,47.24 13.34,46.35 15.24,46.35 24.13,37.47 v24.13,31.11 26.67,28.57 27.18,28.57 28,29.4 U1.17
  Bottom 0.381: ICSP.3 46.35,28.57 41.27,28.57 40.64,29.21 39.37,29.21 38.73,28.57 30.48,28.57 27.94,31.11 v24.13,31.11 | v12.45,48.26 IOH.6
SS  (via drill 0.9 pad 1.52)
  Top 0.381: IOH.3 20.07,45.34 27.3,38.1 27.3,34.42 29.05,32.67 U1.14
  Bottom 0.381: IOH.3 v20.07,48.26
VIN  (via drill 0.9 pad 1.52)
  Top 0.813: CN2.1 v11.43,17.78 v13.97,17.78 v16.51,17.78 v19.05,17.78 22.86,17.78 29.21,11.43 POWER.8 v29.21,5.08
  Bottom 0.813: v52.07,10.16 31.11,10.16 29.21,8.26 POWER.8 | CN2.1 v19.05,17.78
XTAL1
  Top 0.381: X1.3 37.83,37.39 R2.1 36.23,35.98 35.81,35.56 35.27,35.56 U1.7
XTAL2
  Top 0.381: X1.1 36.63,38.59 R2.2 35.21,36.63 U1.8

### Text on the board
tPlace: 13 | 12 | 11 | 10 | 9 | 8 | 7 | 6 | 5 | 4 | 3 | 2 | 1 | 0 | GND | +5V | ADC6 | VIN | ADC7 | GND | +5V | VIN
bPlace: CC-MEGA328-01
tNames: AREF | GND | # | # | # | # | # | # | SCL | SDA | TX | RX | 1 | IOREF | RESET | 3V3 | 5V | GND | VIN | A0 | A1 | A2 | A3 | A4 | A5
214bmp: D:/SmartProjects/Snc/a4_bn_logo2.bmp